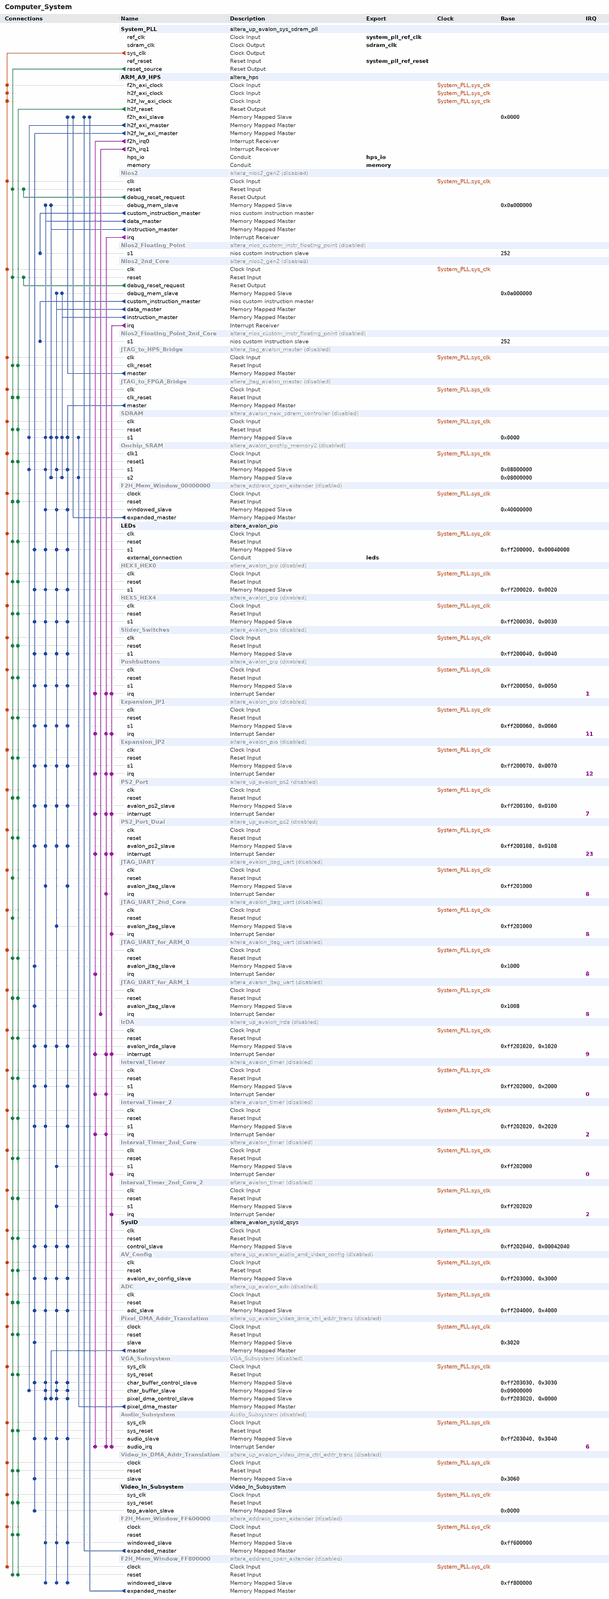
[diagram p0: system contents, whole]
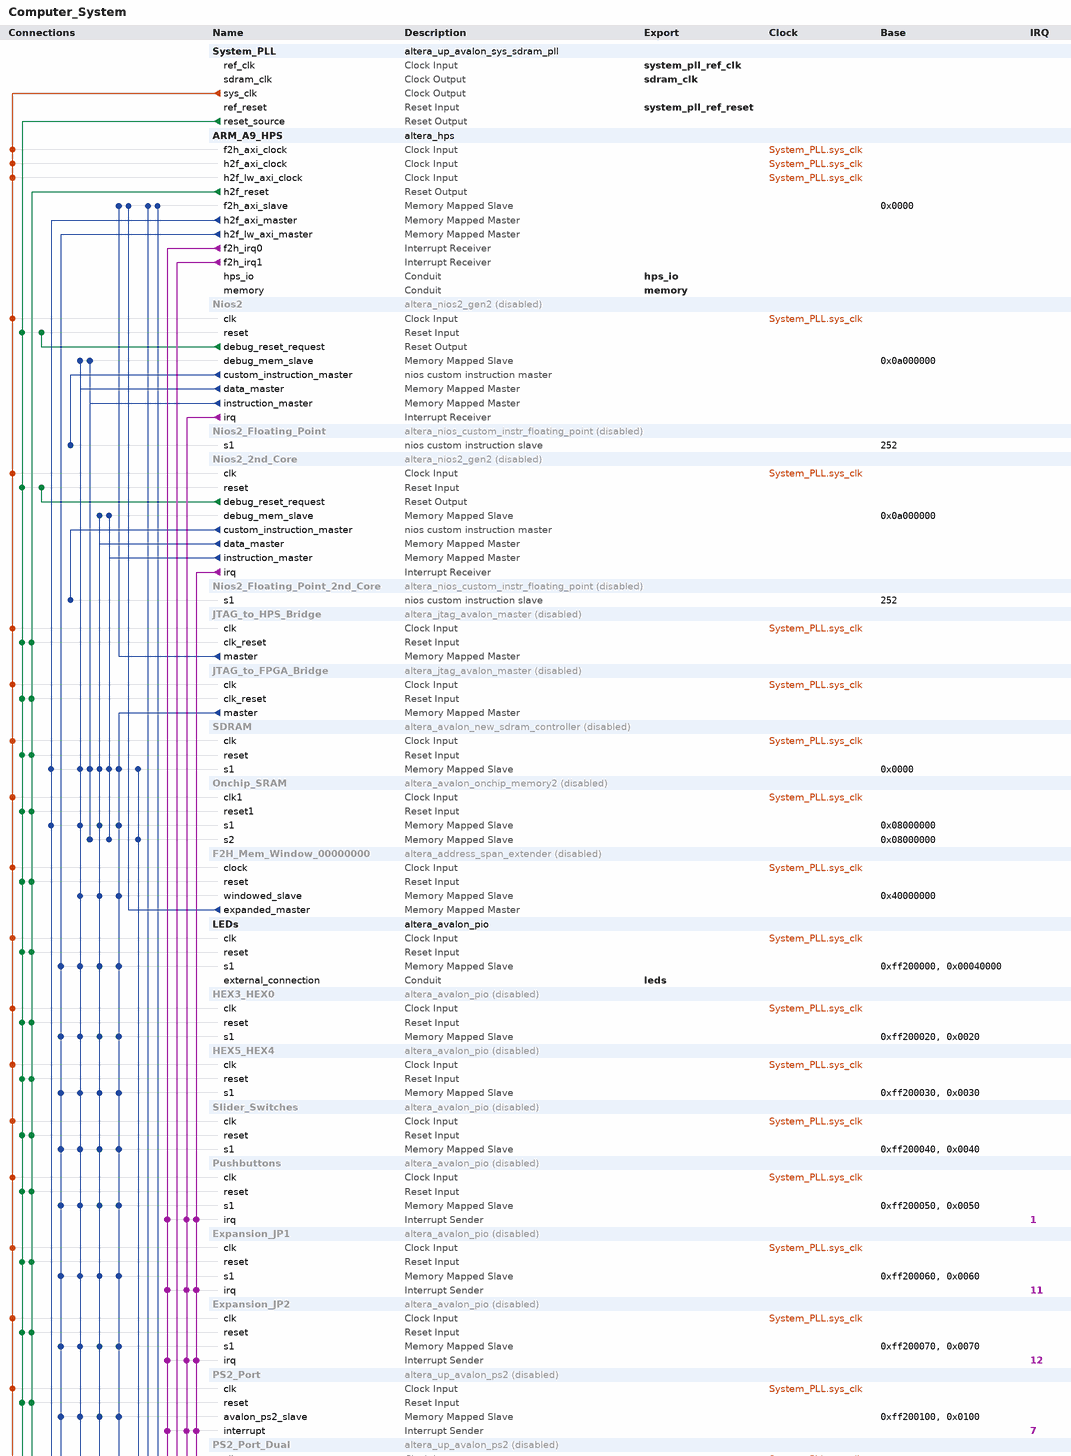
[diagram p1: system contents, upper part]
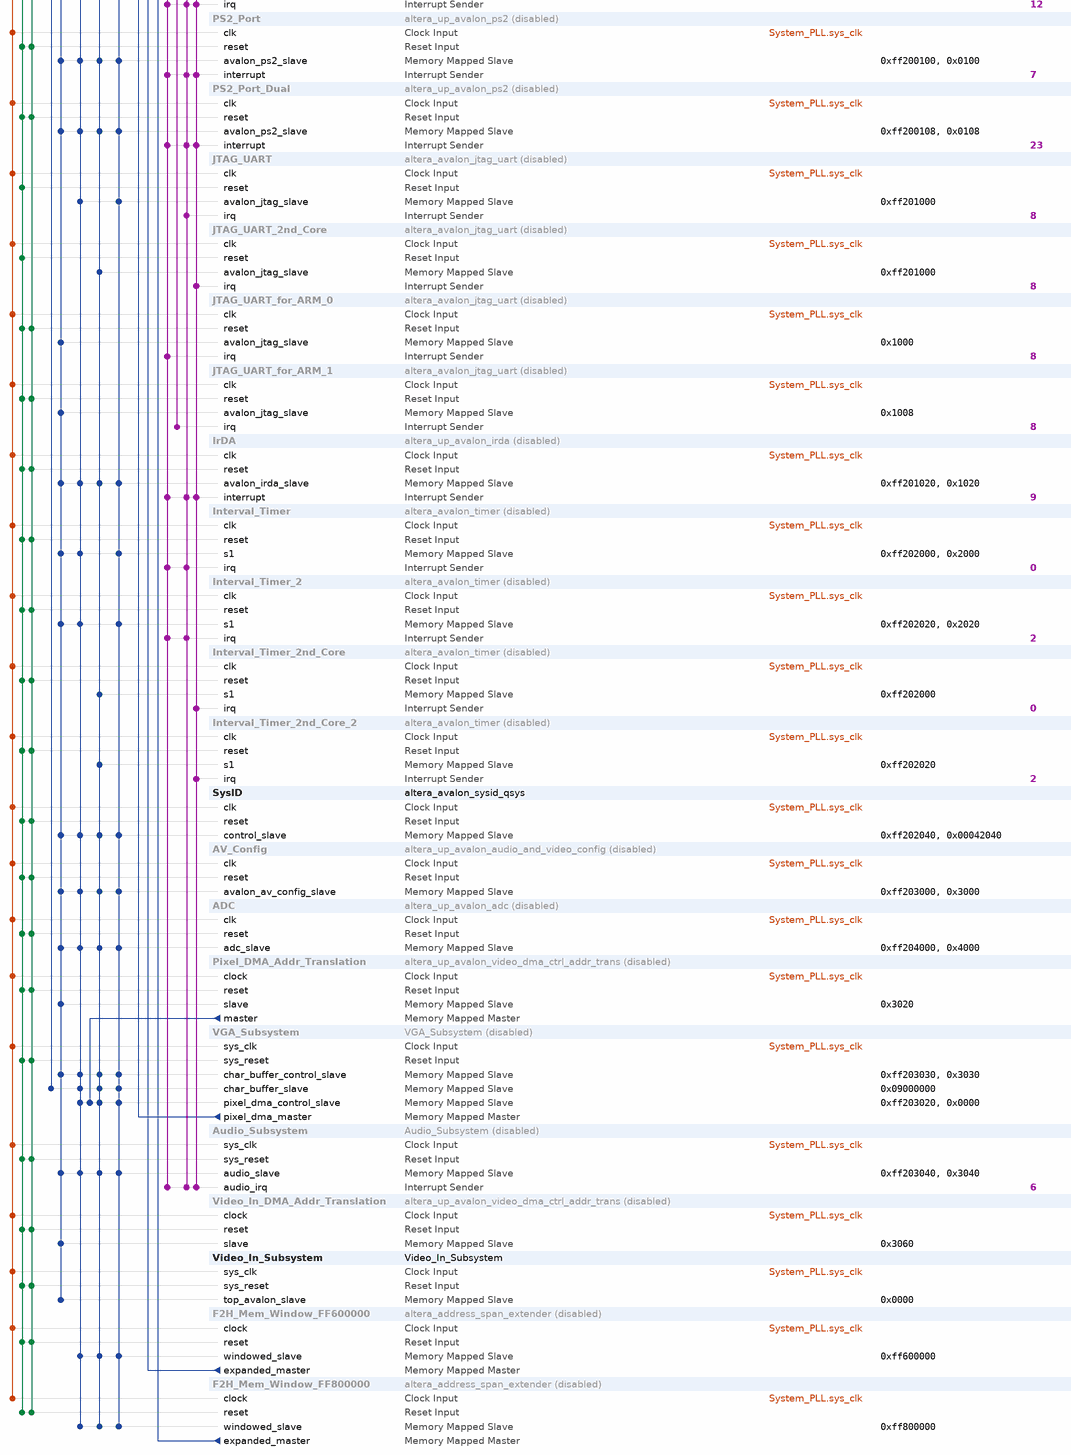
[diagram p2: system contents, lower part]
# Platform Designer (Qsys) system Computer_System, Cyclone V 5CSEMA5F31C6
# Parameters at their usual value, and those the tool derives, are not listed.
package require -exact qsys 16.1
create_system Computer_System
set_project_property DEVICE_FAMILY {Cyclone V}
set_project_property DEVICE 5CSEMA5F31C6

add_instance System_PLL altera_up_avalon_sys_sdram_pll 16.1
set_instance_parameter_value System_PLL CV_boards DE1-SoC
set_instance_parameter_value System_PLL gui_outclk 100.0
set_instance_parameter_value System_PLL gui_refclk 50.0

add_instance ARM_A9_HPS altera_hps 16.1
set_instance_parameter_value ARM_A9_HPS EMAC1_Mode RGMII
set_instance_parameter_value ARM_A9_HPS EMAC1_PinMuxing {HPS I/O Set 0}
set_instance_parameter_value ARM_A9_HPS F2SCLK_COLDRST_Enable false
set_instance_parameter_value ARM_A9_HPS F2SCLK_DBGRST_Enable false
set_instance_parameter_value ARM_A9_HPS F2SCLK_WARMRST_Enable false
set_instance_parameter_value ARM_A9_HPS F2SINTERRUPT_Enable true
set_instance_parameter_value ARM_A9_HPS F2S_Width 2
set_instance_parameter_value ARM_A9_HPS FPGA_PERIPHERAL_OUTPUT_CLOCK_FREQ_EMAC0_GTX_CLK 125
set_instance_parameter_value ARM_A9_HPS FPGA_PERIPHERAL_OUTPUT_CLOCK_FREQ_EMAC0_MD_CLK 100.0
set_instance_parameter_value ARM_A9_HPS FPGA_PERIPHERAL_OUTPUT_CLOCK_FREQ_EMAC1_GTX_CLK 125
set_instance_parameter_value ARM_A9_HPS FPGA_PERIPHERAL_OUTPUT_CLOCK_FREQ_EMAC1_MD_CLK 100.0
set_instance_parameter_value ARM_A9_HPS HPS_PROTOCOL DDR3
set_instance_parameter_value ARM_A9_HPS I2C0_Mode I2C
set_instance_parameter_value ARM_A9_HPS I2C0_PinMuxing {HPS I/O Set 0}
set_instance_parameter_value ARM_A9_HPS I2C1_Mode I2C
set_instance_parameter_value ARM_A9_HPS I2C1_PinMuxing {HPS I/O Set 0}
set_instance_parameter_value ARM_A9_HPS LWH2F_Enable true
set_instance_parameter_value ARM_A9_HPS MEM_BANKADDR_WIDTH 3
set_instance_parameter_value ARM_A9_HPS MEM_CLK_FREQ 400.0
set_instance_parameter_value ARM_A9_HPS MEM_COL_ADDR_WIDTH 10
set_instance_parameter_value ARM_A9_HPS MEM_DQ_WIDTH 32
set_instance_parameter_value ARM_A9_HPS MEM_DRV_STR RZQ/7
set_instance_parameter_value ARM_A9_HPS MEM_ROW_ADDR_WIDTH 15
set_instance_parameter_value ARM_A9_HPS MEM_RTT_NOM RZQ/4
set_instance_parameter_value ARM_A9_HPS MEM_RTT_WR RZQ/4
set_instance_parameter_value ARM_A9_HPS MEM_TCL 11
set_instance_parameter_value ARM_A9_HPS MEM_TFAW_NS 30.0
set_instance_parameter_value ARM_A9_HPS MEM_TRAS_NS 35.0
set_instance_parameter_value ARM_A9_HPS MEM_TRCD_NS 13.75
set_instance_parameter_value ARM_A9_HPS MEM_TRFC_NS 260.0
set_instance_parameter_value ARM_A9_HPS MEM_TRP_NS 13.75
set_instance_parameter_value ARM_A9_HPS MEM_VENDOR JEDEC
set_instance_parameter_value ARM_A9_HPS MEM_WTCL 8
set_instance_parameter_value ARM_A9_HPS QSPI_Mode {1 SS}
set_instance_parameter_value ARM_A9_HPS QSPI_PinMuxing {HPS I/O Set 0}
set_instance_parameter_value ARM_A9_HPS REF_CLK_FREQ 25.0
set_instance_parameter_value ARM_A9_HPS S2FCLK_USER2CLK 5
set_instance_parameter_value ARM_A9_HPS S2F_Width 3
set_instance_parameter_value ARM_A9_HPS SDIO_Mode {4-bit Data}
set_instance_parameter_value ARM_A9_HPS SDIO_PinMuxing {HPS I/O Set 0}
set_instance_parameter_value ARM_A9_HPS SPIM1_Mode {Single Slave Select}
set_instance_parameter_value ARM_A9_HPS SPIM1_PinMuxing {HPS I/O Set 0}
set_instance_parameter_value ARM_A9_HPS STM_Enable false
set_instance_parameter_value ARM_A9_HPS TIMING_BOARD_AC_SKEW 0.03
set_instance_parameter_value ARM_A9_HPS TIMING_BOARD_AC_TO_CK_SKEW 0.0
set_instance_parameter_value ARM_A9_HPS TIMING_BOARD_DQ_TO_DQS_SKEW 0.0
set_instance_parameter_value ARM_A9_HPS TIMING_BOARD_MAX_CK_DELAY 0.03
set_instance_parameter_value ARM_A9_HPS TIMING_BOARD_MAX_DQS_DELAY 0.02
set_instance_parameter_value ARM_A9_HPS TIMING_BOARD_SKEW_BETWEEN_DQS 0.08
set_instance_parameter_value ARM_A9_HPS TIMING_BOARD_SKEW_CKDQS_DIMM_MAX 0.16
set_instance_parameter_value ARM_A9_HPS TIMING_BOARD_SKEW_CKDQS_DIMM_MIN 0.09
set_instance_parameter_value ARM_A9_HPS TIMING_BOARD_SKEW_WITHIN_DQS 0.01
set_instance_parameter_value ARM_A9_HPS TIMING_TDH 65
set_instance_parameter_value ARM_A9_HPS TIMING_TDQSCK 255
set_instance_parameter_value ARM_A9_HPS TIMING_TDQSQ 125
set_instance_parameter_value ARM_A9_HPS TIMING_TDS 30
set_instance_parameter_value ARM_A9_HPS TIMING_TIH 140
set_instance_parameter_value ARM_A9_HPS TIMING_TIS 180
set_instance_parameter_value ARM_A9_HPS TIMING_TQSH 0.4
set_instance_parameter_value ARM_A9_HPS UART0_Mode {No Flow Control}
set_instance_parameter_value ARM_A9_HPS UART0_PinMuxing {HPS I/O Set 0}
set_instance_parameter_value ARM_A9_HPS USB1_Mode SDR
set_instance_parameter_value ARM_A9_HPS USB1_PinMuxing {HPS I/O Set 0}
set_instance_parameter_value ARM_A9_HPS desired_cfg_clk_mhz 100.0
set_instance_parameter_value ARM_A9_HPS desired_qspi_clk_mhz 400.0
set_instance_parameter_value ARM_A9_HPS use_default_mpu_clk false

add_instance Nios2 altera_nios2_gen2 16.1
set_instance_property Nios2 ENABLED false
set_instance_parameter_value Nios2 dcache_size 0
set_instance_parameter_value Nios2 debug_datatrigger 2
set_instance_parameter_value Nios2 debug_hwbreakpoint 2
set_instance_parameter_value Nios2 debug_traceType instruction_trace
set_instance_parameter_value Nios2 dividerType srt2
set_instance_parameter_value Nios2 exceptionSlave SDRAM.s1
set_instance_parameter_value Nios2 icache_size 4096
set_instance_parameter_value Nios2 impl Fast
set_instance_parameter_value Nios2 mul_64_impl 1
set_instance_parameter_value Nios2 mul_shift_choice 1
set_instance_parameter_value Nios2 resetSlave SDRAM.s1
set_instance_parameter_value Nios2 resetrequest_enabled false
set_instance_parameter_value Nios2 setting_support31bitdcachebypass false

add_instance Nios2_Floating_Point altera_nios_custom_instr_floating_point 16.1
set_instance_property Nios2_Floating_Point ENABLED false

add_instance Nios2_2nd_Core altera_nios2_gen2 16.1
set_instance_property Nios2_2nd_Core ENABLED false
set_instance_parameter_value Nios2_2nd_Core cpuID 1
set_instance_parameter_value Nios2_2nd_Core dcache_size 0
set_instance_parameter_value Nios2_2nd_Core debug_datatrigger 2
set_instance_parameter_value Nios2_2nd_Core debug_hwbreakpoint 2
set_instance_parameter_value Nios2_2nd_Core debug_traceType instruction_trace
set_instance_parameter_value Nios2_2nd_Core dividerType srt2
set_instance_parameter_value Nios2_2nd_Core exceptionOffset 33554464
set_instance_parameter_value Nios2_2nd_Core exceptionSlave SDRAM.s1
set_instance_parameter_value Nios2_2nd_Core icache_size 4096
set_instance_parameter_value Nios2_2nd_Core impl Fast
set_instance_parameter_value Nios2_2nd_Core mul_64_impl 1
set_instance_parameter_value Nios2_2nd_Core mul_shift_choice 1
set_instance_parameter_value Nios2_2nd_Core resetOffset 33554432
set_instance_parameter_value Nios2_2nd_Core resetSlave SDRAM.s1
set_instance_parameter_value Nios2_2nd_Core resetrequest_enabled false
set_instance_parameter_value Nios2_2nd_Core setting_support31bitdcachebypass false

add_instance Nios2_Floating_Point_2nd_Core altera_nios_custom_instr_floating_point 16.1
set_instance_property Nios2_Floating_Point_2nd_Core ENABLED false

add_instance JTAG_to_HPS_Bridge altera_jtag_avalon_master 16.1
set_instance_property JTAG_to_HPS_Bridge ENABLED false

add_instance JTAG_to_FPGA_Bridge altera_jtag_avalon_master 16.1
set_instance_property JTAG_to_FPGA_Bridge ENABLED false

add_instance SDRAM altera_avalon_new_sdram_controller 16.1
set_instance_property SDRAM ENABLED false
set_instance_parameter_value SDRAM TAC 5.5
set_instance_parameter_value SDRAM TRCD 20.0
set_instance_parameter_value SDRAM TRP 20.0
set_instance_parameter_value SDRAM casLatency 3
set_instance_parameter_value SDRAM columnWidth 10
set_instance_parameter_value SDRAM dataWidth 16
set_instance_parameter_value SDRAM generateSimulationModel true
set_instance_parameter_value SDRAM model single_Micron_MT48LC4M32B2_7_chip
set_instance_parameter_value SDRAM numberOfBanks 4
set_instance_parameter_value SDRAM numberOfChipSelects 1
set_instance_parameter_value SDRAM powerUpDelay 100.0
set_instance_parameter_value SDRAM refreshPeriod 15.625
set_instance_parameter_value SDRAM rowWidth 13

add_instance Onchip_SRAM altera_avalon_onchip_memory2 16.1
set_instance_property Onchip_SRAM ENABLED false
set_instance_parameter_value Onchip_SRAM dataWidth 32
set_instance_parameter_value Onchip_SRAM dualPort true
set_instance_parameter_value Onchip_SRAM initMemContent true
set_instance_parameter_value Onchip_SRAM initializationFileName onchip_mem.hex
set_instance_parameter_value Onchip_SRAM memorySize 262144
set_instance_parameter_value Onchip_SRAM singleClockOperation true

add_instance F2H_Mem_Window_00000000 altera_address_span_extender 16.1
set_instance_property F2H_Mem_Window_00000000 ENABLED false
set_instance_parameter_value F2H_Mem_Window_00000000 BURSTCOUNT_WIDTH 1
set_instance_parameter_value F2H_Mem_Window_00000000 DATA_WIDTH 32
set_instance_parameter_value F2H_Mem_Window_00000000 ENABLE_SLAVE_PORT false
set_instance_parameter_value F2H_Mem_Window_00000000 MASTER_ADDRESS_DEF 0
set_instance_parameter_value F2H_Mem_Window_00000000 MAX_PENDING_READS 1
set_instance_parameter_value F2H_Mem_Window_00000000 SLAVE_ADDRESS_WIDTH 28

add_instance LEDs altera_avalon_pio 16.1
set_instance_parameter_value LEDs direction Output
set_instance_parameter_value LEDs width 10

add_instance HEX3_HEX0 altera_avalon_pio 16.1
set_instance_property HEX3_HEX0 ENABLED false
set_instance_parameter_value HEX3_HEX0 direction Output
set_instance_parameter_value HEX3_HEX0 width 32

add_instance HEX5_HEX4 altera_avalon_pio 16.1
set_instance_property HEX5_HEX4 ENABLED false
set_instance_parameter_value HEX5_HEX4 direction Output
set_instance_parameter_value HEX5_HEX4 width 16

add_instance Slider_Switches altera_avalon_pio 16.1
set_instance_property Slider_Switches ENABLED false
set_instance_parameter_value Slider_Switches direction Input
set_instance_parameter_value Slider_Switches simDoTestBenchWiring true
set_instance_parameter_value Slider_Switches width 10

add_instance Pushbuttons altera_avalon_pio 16.1
set_instance_property Pushbuttons ENABLED false
set_instance_parameter_value Pushbuttons bitClearingEdgeCapReg true
set_instance_parameter_value Pushbuttons captureEdge true
set_instance_parameter_value Pushbuttons direction Input
set_instance_parameter_value Pushbuttons edgeType FALLING
set_instance_parameter_value Pushbuttons generateIRQ true
set_instance_parameter_value Pushbuttons irqType EDGE
set_instance_parameter_value Pushbuttons simDoTestBenchWiring true
set_instance_parameter_value Pushbuttons width 4

add_instance Expansion_JP1 altera_avalon_pio 16.1
set_instance_property Expansion_JP1 ENABLED false
set_instance_parameter_value Expansion_JP1 bitClearingEdgeCapReg true
set_instance_parameter_value Expansion_JP1 captureEdge true
set_instance_parameter_value Expansion_JP1 direction Bidir
set_instance_parameter_value Expansion_JP1 edgeType FALLING
set_instance_parameter_value Expansion_JP1 generateIRQ true
set_instance_parameter_value Expansion_JP1 irqType EDGE
set_instance_parameter_value Expansion_JP1 simDoTestBenchWiring true
set_instance_parameter_value Expansion_JP1 width 32

add_instance Expansion_JP2 altera_avalon_pio 16.1
set_instance_property Expansion_JP2 ENABLED false
set_instance_parameter_value Expansion_JP2 bitClearingEdgeCapReg true
set_instance_parameter_value Expansion_JP2 captureEdge true
set_instance_parameter_value Expansion_JP2 direction Bidir
set_instance_parameter_value Expansion_JP2 edgeType FALLING
set_instance_parameter_value Expansion_JP2 generateIRQ true
set_instance_parameter_value Expansion_JP2 irqType EDGE
set_instance_parameter_value Expansion_JP2 simDoTestBenchWiring true
set_instance_parameter_value Expansion_JP2 width 32

add_instance PS2_Port altera_up_avalon_ps2 16.1
set_instance_property PS2_Port ENABLED false

add_instance PS2_Port_Dual altera_up_avalon_ps2 16.1
set_instance_property PS2_Port_Dual ENABLED false

add_instance JTAG_UART altera_avalon_jtag_uart 16.1
set_instance_property JTAG_UART ENABLED false
set_instance_parameter_value JTAG_UART simInteractiveOptions NO_INTERACTIVE_WINDOWS

add_instance JTAG_UART_2nd_Core altera_avalon_jtag_uart 16.1
set_instance_property JTAG_UART_2nd_Core ENABLED false
set_instance_parameter_value JTAG_UART_2nd_Core simInteractiveOptions NO_INTERACTIVE_WINDOWS

add_instance JTAG_UART_for_ARM_0 altera_avalon_jtag_uart 16.1
set_instance_property JTAG_UART_for_ARM_0 ENABLED false
set_instance_parameter_value JTAG_UART_for_ARM_0 simInteractiveOptions NO_INTERACTIVE_WINDOWS

add_instance JTAG_UART_for_ARM_1 altera_avalon_jtag_uart 16.1
set_instance_property JTAG_UART_for_ARM_1 ENABLED false
set_instance_parameter_value JTAG_UART_for_ARM_1 simInteractiveOptions NO_INTERACTIVE_WINDOWS

add_instance IrDA altera_up_avalon_irda 16.1
set_instance_property IrDA ENABLED false
set_instance_parameter_value IrDA baud 115200
set_instance_parameter_value IrDA clk_rate 100000000
set_instance_parameter_value IrDA parity None

add_instance Interval_Timer altera_avalon_timer 16.1
set_instance_property Interval_Timer ENABLED false
set_instance_parameter_value Interval_Timer period 125.0
set_instance_parameter_value Interval_Timer periodUnits MSEC

add_instance Interval_Timer_2 altera_avalon_timer 16.1
set_instance_property Interval_Timer_2 ENABLED false
set_instance_parameter_value Interval_Timer_2 period 125.0
set_instance_parameter_value Interval_Timer_2 periodUnits MSEC

add_instance Interval_Timer_2nd_Core altera_avalon_timer 16.1
set_instance_property Interval_Timer_2nd_Core ENABLED false
set_instance_parameter_value Interval_Timer_2nd_Core period 125.0
set_instance_parameter_value Interval_Timer_2nd_Core periodUnits MSEC

add_instance Interval_Timer_2nd_Core_2 altera_avalon_timer 16.1
set_instance_property Interval_Timer_2nd_Core_2 ENABLED false
set_instance_parameter_value Interval_Timer_2nd_Core_2 period 125.0
set_instance_parameter_value Interval_Timer_2nd_Core_2 periodUnits MSEC

add_instance SysID altera_avalon_sysid_qsys 16.1
set_instance_parameter_value SysID id 0

add_instance AV_Config altera_up_avalon_audio_and_video_config 16.1
set_instance_property AV_Config ENABLED false
set_instance_parameter_value AV_Config audio_in {Microphone to ADC}
set_instance_parameter_value AV_Config bit_length 32
set_instance_parameter_value AV_Config board DE1-SoC
set_instance_parameter_value AV_Config line_in_bypass true
set_instance_parameter_value AV_Config sampling_rate {48 kHz}

add_instance ADC altera_up_avalon_adc 16.1
set_instance_property ADC ENABLED false
set_instance_parameter_value ADC board DE1-SoC
set_instance_parameter_value ADC numch_ 8

add_instance Pixel_DMA_Addr_Translation altera_up_avalon_video_dma_ctrl_addr_trans 16.1
set_instance_property Pixel_DMA_Addr_Translation ENABLED false

add_instance VGA_Subsystem VGA_Subsystem 1.0
set_instance_property VGA_Subsystem ENABLED false

add_instance Audio_Subsystem Audio_Subsystem 1.0
set_instance_property Audio_Subsystem ENABLED false

add_instance Video_In_DMA_Addr_Translation altera_up_avalon_video_dma_ctrl_addr_trans 16.1
set_instance_property Video_In_DMA_Addr_Translation ENABLED false

add_instance Video_In_Subsystem Video_In_Subsystem 1.0

add_instance F2H_Mem_Window_FF600000 altera_address_span_extender 16.1
set_instance_property F2H_Mem_Window_FF600000 ENABLED false
set_instance_parameter_value F2H_Mem_Window_FF600000 BURSTCOUNT_WIDTH 1
set_instance_parameter_value F2H_Mem_Window_FF600000 DATA_WIDTH 32
set_instance_parameter_value F2H_Mem_Window_FF600000 ENABLE_SLAVE_PORT false
set_instance_parameter_value F2H_Mem_Window_FF600000 MASTER_ADDRESS_DEF 4284481536
set_instance_parameter_value F2H_Mem_Window_FF600000 MAX_PENDING_READS 1
set_instance_parameter_value F2H_Mem_Window_FF600000 SLAVE_ADDRESS_WIDTH 19

add_instance F2H_Mem_Window_FF800000 altera_address_span_extender 16.1
set_instance_property F2H_Mem_Window_FF800000 ENABLED false
set_instance_parameter_value F2H_Mem_Window_FF800000 BURSTCOUNT_WIDTH 1
set_instance_parameter_value F2H_Mem_Window_FF800000 DATA_WIDTH 32
set_instance_parameter_value F2H_Mem_Window_FF800000 ENABLE_SLAVE_PORT false
set_instance_parameter_value F2H_Mem_Window_FF800000 MASTER_ADDRESS_DEF 4286578688
set_instance_parameter_value F2H_Mem_Window_FF800000 MAX_PENDING_READS 1
set_instance_parameter_value F2H_Mem_Window_FF800000 SLAVE_ADDRESS_WIDTH 21

# connections
add_connection System_PLL.sys_clk ADC.clk clock
add_connection System_PLL.sys_clk ARM_A9_HPS.f2h_axi_clock clock
add_connection System_PLL.sys_clk ARM_A9_HPS.h2f_axi_clock clock
add_connection System_PLL.sys_clk ARM_A9_HPS.h2f_lw_axi_clock clock
add_connection System_PLL.sys_clk Audio_Subsystem.sys_clk clock
add_connection System_PLL.sys_clk AV_Config.clk clock
add_connection System_PLL.sys_clk Expansion_JP1.clk clock
add_connection System_PLL.sys_clk Expansion_JP2.clk clock
add_connection System_PLL.sys_clk F2H_Mem_Window_00000000.clock clock
add_connection System_PLL.sys_clk F2H_Mem_Window_FF600000.clock clock
add_connection System_PLL.sys_clk F2H_Mem_Window_FF800000.clock clock
add_connection System_PLL.sys_clk HEX3_HEX0.clk clock
add_connection System_PLL.sys_clk HEX5_HEX4.clk clock
add_connection System_PLL.sys_clk Interval_Timer.clk clock
add_connection System_PLL.sys_clk Interval_Timer_2.clk clock
add_connection System_PLL.sys_clk Interval_Timer_2nd_Core.clk clock
add_connection System_PLL.sys_clk Interval_Timer_2nd_Core_2.clk clock
add_connection System_PLL.sys_clk IrDA.clk clock
add_connection System_PLL.sys_clk JTAG_to_FPGA_Bridge.clk clock
add_connection System_PLL.sys_clk JTAG_to_HPS_Bridge.clk clock
add_connection System_PLL.sys_clk JTAG_UART.clk clock
add_connection System_PLL.sys_clk JTAG_UART_2nd_Core.clk clock
add_connection System_PLL.sys_clk JTAG_UART_for_ARM_0.clk clock
add_connection System_PLL.sys_clk JTAG_UART_for_ARM_1.clk clock
add_connection System_PLL.sys_clk LEDs.clk clock
add_connection System_PLL.sys_clk Nios2.clk clock
add_connection System_PLL.sys_clk Nios2_2nd_Core.clk clock
add_connection System_PLL.sys_clk Onchip_SRAM.clk1 clock
add_connection System_PLL.sys_clk Pixel_DMA_Addr_Translation.clock clock
add_connection System_PLL.sys_clk PS2_Port.clk clock
add_connection System_PLL.sys_clk PS2_Port_Dual.clk clock
add_connection System_PLL.sys_clk Pushbuttons.clk clock
add_connection System_PLL.sys_clk SDRAM.clk clock
add_connection System_PLL.sys_clk Slider_Switches.clk clock
add_connection System_PLL.sys_clk SysID.clk clock
add_connection System_PLL.sys_clk VGA_Subsystem.sys_clk clock
add_connection System_PLL.sys_clk Video_In_DMA_Addr_Translation.clock clock
add_connection System_PLL.sys_clk Video_In_Subsystem.sys_clk clock
add_connection ARM_A9_HPS.h2f_reset ADC.reset reset
add_connection ARM_A9_HPS.h2f_reset Audio_Subsystem.sys_reset reset
add_connection ARM_A9_HPS.h2f_reset AV_Config.reset reset
add_connection ARM_A9_HPS.h2f_reset Expansion_JP1.reset reset
add_connection ARM_A9_HPS.h2f_reset Expansion_JP2.reset reset
add_connection ARM_A9_HPS.h2f_reset F2H_Mem_Window_00000000.reset reset
add_connection ARM_A9_HPS.h2f_reset F2H_Mem_Window_FF600000.reset reset
add_connection ARM_A9_HPS.h2f_reset F2H_Mem_Window_FF800000.reset reset
add_connection ARM_A9_HPS.h2f_reset HEX3_HEX0.reset reset
add_connection ARM_A9_HPS.h2f_reset HEX5_HEX4.reset reset
add_connection ARM_A9_HPS.h2f_reset Interval_Timer.reset reset
add_connection ARM_A9_HPS.h2f_reset Interval_Timer_2.reset reset
add_connection ARM_A9_HPS.h2f_reset Interval_Timer_2nd_Core.reset reset
add_connection ARM_A9_HPS.h2f_reset Interval_Timer_2nd_Core_2.reset reset
add_connection ARM_A9_HPS.h2f_reset IrDA.reset reset
add_connection ARM_A9_HPS.h2f_reset JTAG_to_FPGA_Bridge.clk_reset reset
add_connection ARM_A9_HPS.h2f_reset JTAG_to_HPS_Bridge.clk_reset reset
add_connection ARM_A9_HPS.h2f_reset JTAG_UART_for_ARM_0.reset reset
add_connection ARM_A9_HPS.h2f_reset JTAG_UART_for_ARM_1.reset reset
add_connection ARM_A9_HPS.h2f_reset LEDs.reset reset
add_connection ARM_A9_HPS.h2f_reset Onchip_SRAM.reset1 reset
add_connection ARM_A9_HPS.h2f_reset Pixel_DMA_Addr_Translation.reset reset
add_connection ARM_A9_HPS.h2f_reset PS2_Port.reset reset
add_connection ARM_A9_HPS.h2f_reset PS2_Port_Dual.reset reset
add_connection ARM_A9_HPS.h2f_reset Pushbuttons.reset reset
add_connection ARM_A9_HPS.h2f_reset SDRAM.reset reset
add_connection ARM_A9_HPS.h2f_reset Slider_Switches.reset reset
add_connection ARM_A9_HPS.h2f_reset SysID.reset reset
add_connection ARM_A9_HPS.h2f_reset VGA_Subsystem.sys_reset reset
add_connection ARM_A9_HPS.h2f_reset Video_In_DMA_Addr_Translation.reset reset
add_connection ARM_A9_HPS.h2f_reset Video_In_Subsystem.sys_reset reset
add_connection Nios2.debug_reset_request Nios2.reset reset
add_connection Nios2_2nd_Core.debug_reset_request Nios2_2nd_Core.reset reset
add_connection System_PLL.reset_source ADC.reset reset
add_connection System_PLL.reset_source Audio_Subsystem.sys_reset reset
add_connection System_PLL.reset_source AV_Config.reset reset
add_connection System_PLL.reset_source Expansion_JP1.reset reset
add_connection System_PLL.reset_source Expansion_JP2.reset reset
add_connection System_PLL.reset_source F2H_Mem_Window_00000000.reset reset
add_connection System_PLL.reset_source F2H_Mem_Window_FF600000.reset reset
add_connection System_PLL.reset_source F2H_Mem_Window_FF800000.reset reset
add_connection System_PLL.reset_source HEX3_HEX0.reset reset
add_connection System_PLL.reset_source HEX5_HEX4.reset reset
add_connection System_PLL.reset_source Interval_Timer.reset reset
add_connection System_PLL.reset_source Interval_Timer_2.reset reset
add_connection System_PLL.reset_source Interval_Timer_2nd_Core.reset reset
add_connection System_PLL.reset_source Interval_Timer_2nd_Core_2.reset reset
add_connection System_PLL.reset_source IrDA.reset reset
add_connection System_PLL.reset_source JTAG_to_FPGA_Bridge.clk_reset reset
add_connection System_PLL.reset_source JTAG_to_HPS_Bridge.clk_reset reset
add_connection System_PLL.reset_source JTAG_UART.reset reset
add_connection System_PLL.reset_source JTAG_UART_2nd_Core.reset reset
add_connection System_PLL.reset_source JTAG_UART_for_ARM_0.reset reset
add_connection System_PLL.reset_source JTAG_UART_for_ARM_1.reset reset
add_connection System_PLL.reset_source LEDs.reset reset
add_connection System_PLL.reset_source Nios2.reset reset
add_connection System_PLL.reset_source Nios2_2nd_Core.reset reset
add_connection System_PLL.reset_source Onchip_SRAM.reset1 reset
add_connection System_PLL.reset_source Pixel_DMA_Addr_Translation.reset reset
add_connection System_PLL.reset_source PS2_Port.reset reset
add_connection System_PLL.reset_source PS2_Port_Dual.reset reset
add_connection System_PLL.reset_source Pushbuttons.reset reset
add_connection System_PLL.reset_source SDRAM.reset reset
add_connection System_PLL.reset_source Slider_Switches.reset reset
add_connection System_PLL.reset_source SysID.reset reset
add_connection System_PLL.reset_source VGA_Subsystem.sys_reset reset
add_connection System_PLL.reset_source Video_In_DMA_Addr_Translation.reset reset
add_connection System_PLL.reset_source Video_In_Subsystem.sys_reset reset
add_connection ARM_A9_HPS.h2f_axi_master Onchip_SRAM.s1 avalon
set_connection_parameter_value ARM_A9_HPS.h2f_axi_master/Onchip_SRAM.s1 baseAddress 0x08000000
add_connection ARM_A9_HPS.h2f_axi_master SDRAM.s1 avalon
set_connection_parameter_value ARM_A9_HPS.h2f_axi_master/SDRAM.s1 baseAddress 0x0000
add_connection ARM_A9_HPS.h2f_axi_master VGA_Subsystem.char_buffer_slave avalon
set_connection_parameter_value ARM_A9_HPS.h2f_axi_master/VGA_Subsystem.char_buffer_slave baseAddress 0x09000000
add_connection ARM_A9_HPS.h2f_lw_axi_master ADC.adc_slave avalon
set_connection_parameter_value ARM_A9_HPS.h2f_lw_axi_master/ADC.adc_slave baseAddress 0x4000
add_connection ARM_A9_HPS.h2f_lw_axi_master Audio_Subsystem.audio_slave avalon
set_connection_parameter_value ARM_A9_HPS.h2f_lw_axi_master/Audio_Subsystem.audio_slave baseAddress 0x3040
add_connection ARM_A9_HPS.h2f_lw_axi_master AV_Config.avalon_av_config_slave avalon
set_connection_parameter_value ARM_A9_HPS.h2f_lw_axi_master/AV_Config.avalon_av_config_slave baseAddress 0x3000
add_connection ARM_A9_HPS.h2f_lw_axi_master Expansion_JP1.s1 avalon
set_connection_parameter_value ARM_A9_HPS.h2f_lw_axi_master/Expansion_JP1.s1 baseAddress 0x0060
add_connection ARM_A9_HPS.h2f_lw_axi_master Expansion_JP2.s1 avalon
set_connection_parameter_value ARM_A9_HPS.h2f_lw_axi_master/Expansion_JP2.s1 baseAddress 0x0070
add_connection ARM_A9_HPS.h2f_lw_axi_master HEX3_HEX0.s1 avalon
set_connection_parameter_value ARM_A9_HPS.h2f_lw_axi_master/HEX3_HEX0.s1 baseAddress 0x0020
add_connection ARM_A9_HPS.h2f_lw_axi_master HEX5_HEX4.s1 avalon
set_connection_parameter_value ARM_A9_HPS.h2f_lw_axi_master/HEX5_HEX4.s1 baseAddress 0x0030
add_connection ARM_A9_HPS.h2f_lw_axi_master Interval_Timer.s1 avalon
set_connection_parameter_value ARM_A9_HPS.h2f_lw_axi_master/Interval_Timer.s1 baseAddress 0x2000
add_connection ARM_A9_HPS.h2f_lw_axi_master Interval_Timer_2.s1 avalon
set_connection_parameter_value ARM_A9_HPS.h2f_lw_axi_master/Interval_Timer_2.s1 baseAddress 0x2020
add_connection ARM_A9_HPS.h2f_lw_axi_master IrDA.avalon_irda_slave avalon
set_connection_parameter_value ARM_A9_HPS.h2f_lw_axi_master/IrDA.avalon_irda_slave baseAddress 0x1020
add_connection ARM_A9_HPS.h2f_lw_axi_master JTAG_UART_for_ARM_0.avalon_jtag_slave avalon
set_connection_parameter_value ARM_A9_HPS.h2f_lw_axi_master/JTAG_UART_for_ARM_0.avalon_jtag_slave baseAddress 0x1000
add_connection ARM_A9_HPS.h2f_lw_axi_master JTAG_UART_for_ARM_1.avalon_jtag_slave avalon
set_connection_parameter_value ARM_A9_HPS.h2f_lw_axi_master/JTAG_UART_for_ARM_1.avalon_jtag_slave baseAddress 0x1008
add_connection ARM_A9_HPS.h2f_lw_axi_master LEDs.s1 avalon
set_connection_parameter_value ARM_A9_HPS.h2f_lw_axi_master/LEDs.s1 baseAddress 0x00040000
add_connection ARM_A9_HPS.h2f_lw_axi_master Pixel_DMA_Addr_Translation.slave avalon
set_connection_parameter_value ARM_A9_HPS.h2f_lw_axi_master/Pixel_DMA_Addr_Translation.slave baseAddress 0x3020
add_connection ARM_A9_HPS.h2f_lw_axi_master PS2_Port.avalon_ps2_slave avalon
set_connection_parameter_value ARM_A9_HPS.h2f_lw_axi_master/PS2_Port.avalon_ps2_slave baseAddress 0x0100
add_connection ARM_A9_HPS.h2f_lw_axi_master PS2_Port_Dual.avalon_ps2_slave avalon
set_connection_parameter_value ARM_A9_HPS.h2f_lw_axi_master/PS2_Port_Dual.avalon_ps2_slave baseAddress 0x0108
add_connection ARM_A9_HPS.h2f_lw_axi_master Pushbuttons.s1 avalon
set_connection_parameter_value ARM_A9_HPS.h2f_lw_axi_master/Pushbuttons.s1 baseAddress 0x0050
add_connection ARM_A9_HPS.h2f_lw_axi_master Slider_Switches.s1 avalon
set_connection_parameter_value ARM_A9_HPS.h2f_lw_axi_master/Slider_Switches.s1 baseAddress 0x0040
add_connection ARM_A9_HPS.h2f_lw_axi_master SysID.control_slave avalon
set_connection_parameter_value ARM_A9_HPS.h2f_lw_axi_master/SysID.control_slave baseAddress 0x00042040
add_connection ARM_A9_HPS.h2f_lw_axi_master VGA_Subsystem.char_buffer_control_slave avalon
set_connection_parameter_value ARM_A9_HPS.h2f_lw_axi_master/VGA_Subsystem.char_buffer_control_slave baseAddress 0x3030
add_connection ARM_A9_HPS.h2f_lw_axi_master Video_In_DMA_Addr_Translation.slave avalon
set_connection_parameter_value ARM_A9_HPS.h2f_lw_axi_master/Video_In_DMA_Addr_Translation.slave baseAddress 0x3060
add_connection ARM_A9_HPS.h2f_lw_axi_master Video_In_Subsystem.top_avalon_slave avalon
set_connection_parameter_value ARM_A9_HPS.h2f_lw_axi_master/Video_In_Subsystem.top_avalon_slave baseAddress 0x0000
add_connection F2H_Mem_Window_00000000.expanded_master ARM_A9_HPS.f2h_axi_slave avalon
set_connection_parameter_value F2H_Mem_Window_00000000.expanded_master/ARM_A9_HPS.f2h_axi_slave baseAddress 0x0000
add_connection F2H_Mem_Window_FF600000.expanded_master ARM_A9_HPS.f2h_axi_slave avalon
set_connection_parameter_value F2H_Mem_Window_FF600000.expanded_master/ARM_A9_HPS.f2h_axi_slave baseAddress 0x0000
add_connection F2H_Mem_Window_FF800000.expanded_master ARM_A9_HPS.f2h_axi_slave avalon
set_connection_parameter_value F2H_Mem_Window_FF800000.expanded_master/ARM_A9_HPS.f2h_axi_slave baseAddress 0x0000
add_connection JTAG_to_FPGA_Bridge.master ADC.adc_slave avalon
set_connection_parameter_value JTAG_to_FPGA_Bridge.master/ADC.adc_slave baseAddress 0xff204000
add_connection JTAG_to_FPGA_Bridge.master Audio_Subsystem.audio_slave avalon
set_connection_parameter_value JTAG_to_FPGA_Bridge.master/Audio_Subsystem.audio_slave baseAddress 0xff203040
add_connection JTAG_to_FPGA_Bridge.master AV_Config.avalon_av_config_slave avalon
set_connection_parameter_value JTAG_to_FPGA_Bridge.master/AV_Config.avalon_av_config_slave baseAddress 0xff203000
add_connection JTAG_to_FPGA_Bridge.master Expansion_JP1.s1 avalon
set_connection_parameter_value JTAG_to_FPGA_Bridge.master/Expansion_JP1.s1 baseAddress 0xff200060
add_connection JTAG_to_FPGA_Bridge.master Expansion_JP2.s1 avalon
set_connection_parameter_value JTAG_to_FPGA_Bridge.master/Expansion_JP2.s1 baseAddress 0xff200070
add_connection JTAG_to_FPGA_Bridge.master F2H_Mem_Window_00000000.windowed_slave avalon
set_connection_parameter_value JTAG_to_FPGA_Bridge.master/F2H_Mem_Window_00000000.windowed_slave baseAddress 0x40000000
add_connection JTAG_to_FPGA_Bridge.master F2H_Mem_Window_FF600000.windowed_slave avalon
set_connection_parameter_value JTAG_to_FPGA_Bridge.master/F2H_Mem_Window_FF600000.windowed_slave baseAddress 0xff600000
add_connection JTAG_to_FPGA_Bridge.master F2H_Mem_Window_FF800000.windowed_slave avalon
set_connection_parameter_value JTAG_to_FPGA_Bridge.master/F2H_Mem_Window_FF800000.windowed_slave baseAddress 0xff800000
add_connection JTAG_to_FPGA_Bridge.master HEX3_HEX0.s1 avalon
set_connection_parameter_value JTAG_to_FPGA_Bridge.master/HEX3_HEX0.s1 baseAddress 0xff200020
add_connection JTAG_to_FPGA_Bridge.master HEX5_HEX4.s1 avalon
set_connection_parameter_value JTAG_to_FPGA_Bridge.master/HEX5_HEX4.s1 baseAddress 0xff200030
add_connection JTAG_to_FPGA_Bridge.master Interval_Timer.s1 avalon
set_connection_parameter_value JTAG_to_FPGA_Bridge.master/Interval_Timer.s1 baseAddress 0xff202000
add_connection JTAG_to_FPGA_Bridge.master Interval_Timer_2.s1 avalon
set_connection_parameter_value JTAG_to_FPGA_Bridge.master/Interval_Timer_2.s1 baseAddress 0xff202020
add_connection JTAG_to_FPGA_Bridge.master IrDA.avalon_irda_slave avalon
set_connection_parameter_value JTAG_to_FPGA_Bridge.master/IrDA.avalon_irda_slave baseAddress 0xff201020
add_connection JTAG_to_FPGA_Bridge.master JTAG_UART.avalon_jtag_slave avalon
set_connection_parameter_value JTAG_to_FPGA_Bridge.master/JTAG_UART.avalon_jtag_slave baseAddress 0xff201000
add_connection JTAG_to_FPGA_Bridge.master LEDs.s1 avalon
set_connection_parameter_value JTAG_to_FPGA_Bridge.master/LEDs.s1 baseAddress 0xff200000
add_connection JTAG_to_FPGA_Bridge.master Onchip_SRAM.s1 avalon
set_connection_parameter_value JTAG_to_FPGA_Bridge.master/Onchip_SRAM.s1 baseAddress 0x08000000
add_connection JTAG_to_FPGA_Bridge.master PS2_Port.avalon_ps2_slave avalon
set_connection_parameter_value JTAG_to_FPGA_Bridge.master/PS2_Port.avalon_ps2_slave baseAddress 0xff200100
add_connection JTAG_to_FPGA_Bridge.master PS2_Port_Dual.avalon_ps2_slave avalon
set_connection_parameter_value JTAG_to_FPGA_Bridge.master/PS2_Port_Dual.avalon_ps2_slave baseAddress 0xff200108
add_connection JTAG_to_FPGA_Bridge.master Pushbuttons.s1 avalon
set_connection_parameter_value JTAG_to_FPGA_Bridge.master/Pushbuttons.s1 baseAddress 0xff200050
add_connection JTAG_to_FPGA_Bridge.master SDRAM.s1 avalon
set_connection_parameter_value JTAG_to_FPGA_Bridge.master/SDRAM.s1 baseAddress 0x0000
add_connection JTAG_to_FPGA_Bridge.master Slider_Switches.s1 avalon
set_connection_parameter_value JTAG_to_FPGA_Bridge.master/Slider_Switches.s1 baseAddress 0xff200040
add_connection JTAG_to_FPGA_Bridge.master SysID.control_slave avalon
set_connection_parameter_value JTAG_to_FPGA_Bridge.master/SysID.control_slave baseAddress 0xff202040
add_connection JTAG_to_FPGA_Bridge.master VGA_Subsystem.char_buffer_control_slave avalon
set_connection_parameter_value JTAG_to_FPGA_Bridge.master/VGA_Subsystem.char_buffer_control_slave baseAddress 0xff203030
add_connection JTAG_to_FPGA_Bridge.master VGA_Subsystem.char_buffer_slave avalon
set_connection_parameter_value JTAG_to_FPGA_Bridge.master/VGA_Subsystem.char_buffer_slave baseAddress 0x09000000
add_connection JTAG_to_FPGA_Bridge.master VGA_Subsystem.pixel_dma_control_slave avalon
set_connection_parameter_value JTAG_to_FPGA_Bridge.master/VGA_Subsystem.pixel_dma_control_slave baseAddress 0xff203020
add_connection JTAG_to_HPS_Bridge.master ARM_A9_HPS.f2h_axi_slave avalon
set_connection_parameter_value JTAG_to_HPS_Bridge.master/ARM_A9_HPS.f2h_axi_slave baseAddress 0x0000
add_connection Nios2.data_master ADC.adc_slave avalon
set_connection_parameter_value Nios2.data_master/ADC.adc_slave baseAddress 0xff204000
add_connection Nios2.data_master Audio_Subsystem.audio_slave avalon
set_connection_parameter_value Nios2.data_master/Audio_Subsystem.audio_slave baseAddress 0xff203040
add_connection Nios2.data_master AV_Config.avalon_av_config_slave avalon
set_connection_parameter_value Nios2.data_master/AV_Config.avalon_av_config_slave baseAddress 0xff203000
add_connection Nios2.data_master Expansion_JP1.s1 avalon
set_connection_parameter_value Nios2.data_master/Expansion_JP1.s1 baseAddress 0xff200060
add_connection Nios2.data_master Expansion_JP2.s1 avalon
set_connection_parameter_value Nios2.data_master/Expansion_JP2.s1 baseAddress 0xff200070
add_connection Nios2.data_master F2H_Mem_Window_00000000.windowed_slave avalon
set_connection_parameter_value Nios2.data_master/F2H_Mem_Window_00000000.windowed_slave baseAddress 0x40000000
add_connection Nios2.data_master F2H_Mem_Window_FF600000.windowed_slave avalon
set_connection_parameter_value Nios2.data_master/F2H_Mem_Window_FF600000.windowed_slave baseAddress 0xff600000
add_connection Nios2.data_master F2H_Mem_Window_FF800000.windowed_slave avalon
set_connection_parameter_value Nios2.data_master/F2H_Mem_Window_FF800000.windowed_slave baseAddress 0xff800000
add_connection Nios2.data_master HEX3_HEX0.s1 avalon
set_connection_parameter_value Nios2.data_master/HEX3_HEX0.s1 baseAddress 0xff200020
add_connection Nios2.data_master HEX5_HEX4.s1 avalon
set_connection_parameter_value Nios2.data_master/HEX5_HEX4.s1 baseAddress 0xff200030
add_connection Nios2.data_master Interval_Timer.s1 avalon
set_connection_parameter_value Nios2.data_master/Interval_Timer.s1 baseAddress 0xff202000
add_connection Nios2.data_master Interval_Timer_2.s1 avalon
set_connection_parameter_value Nios2.data_master/Interval_Timer_2.s1 baseAddress 0xff202020
add_connection Nios2.data_master IrDA.avalon_irda_slave avalon
set_connection_parameter_value Nios2.data_master/IrDA.avalon_irda_slave baseAddress 0xff201020
add_connection Nios2.data_master JTAG_UART.avalon_jtag_slave avalon
set_connection_parameter_value Nios2.data_master/JTAG_UART.avalon_jtag_slave baseAddress 0xff201000
add_connection Nios2.data_master LEDs.s1 avalon
set_connection_parameter_value Nios2.data_master/LEDs.s1 baseAddress 0xff200000
add_connection Nios2.data_master Nios2.debug_mem_slave avalon
set_connection_parameter_value Nios2.data_master/Nios2.debug_mem_slave baseAddress 0x0a000000
add_connection Nios2.data_master Onchip_SRAM.s1 avalon
set_connection_parameter_value Nios2.data_master/Onchip_SRAM.s1 baseAddress 0x08000000
add_connection Nios2.data_master PS2_Port.avalon_ps2_slave avalon
set_connection_parameter_value Nios2.data_master/PS2_Port.avalon_ps2_slave baseAddress 0xff200100
add_connection Nios2.data_master PS2_Port_Dual.avalon_ps2_slave avalon
set_connection_parameter_value Nios2.data_master/PS2_Port_Dual.avalon_ps2_slave baseAddress 0xff200108
add_connection Nios2.data_master Pushbuttons.s1 avalon
set_connection_parameter_value Nios2.data_master/Pushbuttons.s1 baseAddress 0xff200050
add_connection Nios2.data_master SDRAM.s1 avalon
set_connection_parameter_value Nios2.data_master/SDRAM.s1 baseAddress 0x0000
add_connection Nios2.data_master Slider_Switches.s1 avalon
set_connection_parameter_value Nios2.data_master/Slider_Switches.s1 baseAddress 0xff200040
add_connection Nios2.data_master SysID.control_slave avalon
set_connection_parameter_value Nios2.data_master/SysID.control_slave baseAddress 0xff202040
add_connection Nios2.data_master VGA_Subsystem.char_buffer_control_slave avalon
set_connection_parameter_value Nios2.data_master/VGA_Subsystem.char_buffer_control_slave baseAddress 0xff203030
add_connection Nios2.data_master VGA_Subsystem.char_buffer_slave avalon
set_connection_parameter_value Nios2.data_master/VGA_Subsystem.char_buffer_slave baseAddress 0x09000000
add_connection Nios2.data_master VGA_Subsystem.pixel_dma_control_slave avalon
set_connection_parameter_value Nios2.data_master/VGA_Subsystem.pixel_dma_control_slave baseAddress 0xff203020
add_connection Nios2.instruction_master Nios2.debug_mem_slave avalon
set_connection_parameter_value Nios2.instruction_master/Nios2.debug_mem_slave baseAddress 0x0a000000
add_connection Nios2.instruction_master Onchip_SRAM.s2 avalon
set_connection_parameter_value Nios2.instruction_master/Onchip_SRAM.s2 baseAddress 0x08000000
add_connection Nios2.instruction_master SDRAM.s1 avalon
set_connection_parameter_value Nios2.instruction_master/SDRAM.s1 baseAddress 0x0000
add_connection Nios2_2nd_Core.data_master ADC.adc_slave avalon
set_connection_parameter_value Nios2_2nd_Core.data_master/ADC.adc_slave baseAddress 0xff204000
add_connection Nios2_2nd_Core.data_master Audio_Subsystem.audio_slave avalon
set_connection_parameter_value Nios2_2nd_Core.data_master/Audio_Subsystem.audio_slave baseAddress 0xff203040
add_connection Nios2_2nd_Core.data_master AV_Config.avalon_av_config_slave avalon
set_connection_parameter_value Nios2_2nd_Core.data_master/AV_Config.avalon_av_config_slave baseAddress 0xff203000
add_connection Nios2_2nd_Core.data_master Expansion_JP1.s1 avalon
set_connection_parameter_value Nios2_2nd_Core.data_master/Expansion_JP1.s1 baseAddress 0xff200060
add_connection Nios2_2nd_Core.data_master Expansion_JP2.s1 avalon
set_connection_parameter_value Nios2_2nd_Core.data_master/Expansion_JP2.s1 baseAddress 0xff200070
add_connection Nios2_2nd_Core.data_master F2H_Mem_Window_00000000.windowed_slave avalon
set_connection_parameter_value Nios2_2nd_Core.data_master/F2H_Mem_Window_00000000.windowed_slave baseAddress 0x40000000
add_connection Nios2_2nd_Core.data_master F2H_Mem_Window_FF600000.windowed_slave avalon
set_connection_parameter_value Nios2_2nd_Core.data_master/F2H_Mem_Window_FF600000.windowed_slave baseAddress 0xff600000
add_connection Nios2_2nd_Core.data_master F2H_Mem_Window_FF800000.windowed_slave avalon
set_connection_parameter_value Nios2_2nd_Core.data_master/F2H_Mem_Window_FF800000.windowed_slave baseAddress 0xff800000
add_connection Nios2_2nd_Core.data_master HEX3_HEX0.s1 avalon
set_connection_parameter_value Nios2_2nd_Core.data_master/HEX3_HEX0.s1 baseAddress 0xff200020
add_connection Nios2_2nd_Core.data_master HEX5_HEX4.s1 avalon
set_connection_parameter_value Nios2_2nd_Core.data_master/HEX5_HEX4.s1 baseAddress 0xff200030
add_connection Nios2_2nd_Core.data_master Interval_Timer_2nd_Core.s1 avalon
set_connection_parameter_value Nios2_2nd_Core.data_master/Interval_Timer_2nd_Core.s1 baseAddress 0xff202000
add_connection Nios2_2nd_Core.data_master Interval_Timer_2nd_Core_2.s1 avalon
set_connection_parameter_value Nios2_2nd_Core.data_master/Interval_Timer_2nd_Core_2.s1 baseAddress 0xff202020
add_connection Nios2_2nd_Core.data_master IrDA.avalon_irda_slave avalon
set_connection_parameter_value Nios2_2nd_Core.data_master/IrDA.avalon_irda_slave baseAddress 0xff201020
add_connection Nios2_2nd_Core.data_master JTAG_UART_2nd_Core.avalon_jtag_slave avalon
set_connection_parameter_value Nios2_2nd_Core.data_master/JTAG_UART_2nd_Core.avalon_jtag_slave baseAddress 0xff201000
add_connection Nios2_2nd_Core.data_master LEDs.s1 avalon
set_connection_parameter_value Nios2_2nd_Core.data_master/LEDs.s1 baseAddress 0xff200000
add_connection Nios2_2nd_Core.data_master Nios2_2nd_Core.debug_mem_slave avalon
set_connection_parameter_value Nios2_2nd_Core.data_master/Nios2_2nd_Core.debug_mem_slave baseAddress 0x0a000000
add_connection Nios2_2nd_Core.data_master Onchip_SRAM.s1 avalon
set_connection_parameter_value Nios2_2nd_Core.data_master/Onchip_SRAM.s1 baseAddress 0x08000000
add_connection Nios2_2nd_Core.data_master PS2_Port.avalon_ps2_slave avalon
set_connection_parameter_value Nios2_2nd_Core.data_master/PS2_Port.avalon_ps2_slave baseAddress 0xff200100
add_connection Nios2_2nd_Core.data_master PS2_Port_Dual.avalon_ps2_slave avalon
set_connection_parameter_value Nios2_2nd_Core.data_master/PS2_Port_Dual.avalon_ps2_slave baseAddress 0xff200108
add_connection Nios2_2nd_Core.data_master Pushbuttons.s1 avalon
set_connection_parameter_value Nios2_2nd_Core.data_master/Pushbuttons.s1 baseAddress 0xff200050
add_connection Nios2_2nd_Core.data_master SDRAM.s1 avalon
set_connection_parameter_value Nios2_2nd_Core.data_master/SDRAM.s1 baseAddress 0x0000
add_connection Nios2_2nd_Core.data_master Slider_Switches.s1 avalon
set_connection_parameter_value Nios2_2nd_Core.data_master/Slider_Switches.s1 baseAddress 0xff200040
add_connection Nios2_2nd_Core.data_master SysID.control_slave avalon
set_connection_parameter_value Nios2_2nd_Core.data_master/SysID.control_slave baseAddress 0xff202040
add_connection Nios2_2nd_Core.data_master VGA_Subsystem.char_buffer_control_slave avalon
set_connection_parameter_value Nios2_2nd_Core.data_master/VGA_Subsystem.char_buffer_control_slave baseAddress 0xff203030
add_connection Nios2_2nd_Core.data_master VGA_Subsystem.char_buffer_slave avalon
set_connection_parameter_value Nios2_2nd_Core.data_master/VGA_Subsystem.char_buffer_slave baseAddress 0x09000000
add_connection Nios2_2nd_Core.data_master VGA_Subsystem.pixel_dma_control_slave avalon
set_connection_parameter_value Nios2_2nd_Core.data_master/VGA_Subsystem.pixel_dma_control_slave baseAddress 0xff203020
add_connection Nios2_2nd_Core.instruction_master Nios2_2nd_Core.debug_mem_slave avalon
set_connection_parameter_value Nios2_2nd_Core.instruction_master/Nios2_2nd_Core.debug_mem_slave baseAddress 0x0a000000
add_connection Nios2_2nd_Core.instruction_master Onchip_SRAM.s2 avalon
set_connection_parameter_value Nios2_2nd_Core.instruction_master/Onchip_SRAM.s2 baseAddress 0x08000000
add_connection Nios2_2nd_Core.instruction_master SDRAM.s1 avalon
set_connection_parameter_value Nios2_2nd_Core.instruction_master/SDRAM.s1 baseAddress 0x0000
add_connection Pixel_DMA_Addr_Translation.master VGA_Subsystem.pixel_dma_control_slave avalon
set_connection_parameter_value Pixel_DMA_Addr_Translation.master/VGA_Subsystem.pixel_dma_control_slave baseAddress 0x0000
add_connection VGA_Subsystem.pixel_dma_master Onchip_SRAM.s2 avalon
set_connection_parameter_value VGA_Subsystem.pixel_dma_master/Onchip_SRAM.s2 baseAddress 0x08000000
add_connection VGA_Subsystem.pixel_dma_master SDRAM.s1 avalon
set_connection_parameter_value VGA_Subsystem.pixel_dma_master/SDRAM.s1 baseAddress 0x0000
add_connection ARM_A9_HPS.f2h_irq0 Audio_Subsystem.audio_irq interrupt
set_connection_parameter_value ARM_A9_HPS.f2h_irq0/Audio_Subsystem.audio_irq irqNumber 6
add_connection ARM_A9_HPS.f2h_irq0 Expansion_JP1.irq interrupt
set_connection_parameter_value ARM_A9_HPS.f2h_irq0/Expansion_JP1.irq irqNumber 11
add_connection ARM_A9_HPS.f2h_irq0 Expansion_JP2.irq interrupt
set_connection_parameter_value ARM_A9_HPS.f2h_irq0/Expansion_JP2.irq irqNumber 12
add_connection ARM_A9_HPS.f2h_irq0 Interval_Timer.irq interrupt
set_connection_parameter_value ARM_A9_HPS.f2h_irq0/Interval_Timer.irq irqNumber 0
add_connection ARM_A9_HPS.f2h_irq0 Interval_Timer_2.irq interrupt
set_connection_parameter_value ARM_A9_HPS.f2h_irq0/Interval_Timer_2.irq irqNumber 2
add_connection ARM_A9_HPS.f2h_irq0 IrDA.interrupt interrupt
set_connection_parameter_value ARM_A9_HPS.f2h_irq0/IrDA.interrupt irqNumber 9
add_connection ARM_A9_HPS.f2h_irq0 JTAG_UART_for_ARM_0.irq interrupt
set_connection_parameter_value ARM_A9_HPS.f2h_irq0/JTAG_UART_for_ARM_0.irq irqNumber 8
add_connection ARM_A9_HPS.f2h_irq0 PS2_Port.interrupt interrupt
set_connection_parameter_value ARM_A9_HPS.f2h_irq0/PS2_Port.interrupt irqNumber 7
add_connection ARM_A9_HPS.f2h_irq0 PS2_Port_Dual.interrupt interrupt
set_connection_parameter_value ARM_A9_HPS.f2h_irq0/PS2_Port_Dual.interrupt irqNumber 23
add_connection ARM_A9_HPS.f2h_irq0 Pushbuttons.irq interrupt
set_connection_parameter_value ARM_A9_HPS.f2h_irq0/Pushbuttons.irq irqNumber 1
add_connection ARM_A9_HPS.f2h_irq1 JTAG_UART_for_ARM_1.irq interrupt
set_connection_parameter_value ARM_A9_HPS.f2h_irq1/JTAG_UART_for_ARM_1.irq irqNumber 8
add_connection Nios2.irq Audio_Subsystem.audio_irq interrupt
set_connection_parameter_value Nios2.irq/Audio_Subsystem.audio_irq irqNumber 6
add_connection Nios2.irq Expansion_JP1.irq interrupt
set_connection_parameter_value Nios2.irq/Expansion_JP1.irq irqNumber 11
add_connection Nios2.irq Expansion_JP2.irq interrupt
set_connection_parameter_value Nios2.irq/Expansion_JP2.irq irqNumber 12
add_connection Nios2.irq Interval_Timer.irq interrupt
set_connection_parameter_value Nios2.irq/Interval_Timer.irq irqNumber 0
add_connection Nios2.irq Interval_Timer_2.irq interrupt
set_connection_parameter_value Nios2.irq/Interval_Timer_2.irq irqNumber 2
add_connection Nios2.irq IrDA.interrupt interrupt
set_connection_parameter_value Nios2.irq/IrDA.interrupt irqNumber 9
add_connection Nios2.irq JTAG_UART.irq interrupt
set_connection_parameter_value Nios2.irq/JTAG_UART.irq irqNumber 8
add_connection Nios2.irq PS2_Port.interrupt interrupt
set_connection_parameter_value Nios2.irq/PS2_Port.interrupt irqNumber 7
add_connection Nios2.irq PS2_Port_Dual.interrupt interrupt
set_connection_parameter_value Nios2.irq/PS2_Port_Dual.interrupt irqNumber 23
add_connection Nios2.irq Pushbuttons.irq interrupt
set_connection_parameter_value Nios2.irq/Pushbuttons.irq irqNumber 1
add_connection Nios2_2nd_Core.irq Audio_Subsystem.audio_irq interrupt
set_connection_parameter_value Nios2_2nd_Core.irq/Audio_Subsystem.audio_irq irqNumber 6
add_connection Nios2_2nd_Core.irq Expansion_JP1.irq interrupt
set_connection_parameter_value Nios2_2nd_Core.irq/Expansion_JP1.irq irqNumber 11
add_connection Nios2_2nd_Core.irq Expansion_JP2.irq interrupt
set_connection_parameter_value Nios2_2nd_Core.irq/Expansion_JP2.irq irqNumber 12
add_connection Nios2_2nd_Core.irq Interval_Timer_2nd_Core.irq interrupt
set_connection_parameter_value Nios2_2nd_Core.irq/Interval_Timer_2nd_Core.irq irqNumber 0
add_connection Nios2_2nd_Core.irq Interval_Timer_2nd_Core_2.irq interrupt
set_connection_parameter_value Nios2_2nd_Core.irq/Interval_Timer_2nd_Core_2.irq irqNumber 2
add_connection Nios2_2nd_Core.irq IrDA.interrupt interrupt
set_connection_parameter_value Nios2_2nd_Core.irq/IrDA.interrupt irqNumber 9
add_connection Nios2_2nd_Core.irq JTAG_UART_2nd_Core.irq interrupt
set_connection_parameter_value Nios2_2nd_Core.irq/JTAG_UART_2nd_Core.irq irqNumber 8
add_connection Nios2_2nd_Core.irq PS2_Port.interrupt interrupt
set_connection_parameter_value Nios2_2nd_Core.irq/PS2_Port.interrupt irqNumber 7
add_connection Nios2_2nd_Core.irq PS2_Port_Dual.interrupt interrupt
set_connection_parameter_value Nios2_2nd_Core.irq/PS2_Port_Dual.interrupt irqNumber 23
add_connection Nios2_2nd_Core.irq Pushbuttons.irq interrupt
set_connection_parameter_value Nios2_2nd_Core.irq/Pushbuttons.irq irqNumber 1
add_connection Nios2.custom_instruction_master Nios2_Floating_Point.s1 nios_custom_instruction
set_connection_parameter_value Nios2.custom_instruction_master/Nios2_Floating_Point.s1 CIName nios2_floating_point
set_connection_parameter_value Nios2.custom_instruction_master/Nios2_Floating_Point.s1 baseAddress 252
add_connection Nios2_2nd_Core.custom_instruction_master Nios2_Floating_Point_2nd_Core.s1 nios_custom_instruction
set_connection_parameter_value Nios2_2nd_Core.custom_instruction_master/Nios2_Floating_Point_2nd_Core.s1 CIName nios2_floating_point_2nd_core
set_connection_parameter_value Nios2_2nd_Core.custom_instruction_master/Nios2_Floating_Point_2nd_Core.s1 baseAddress 252

# exported interfaces
add_interface hps_io conduit end
set_interface_property hps_io EXPORT_OF ARM_A9_HPS.hps_io
add_interface leds conduit end
set_interface_property leds EXPORT_OF LEDs.external_connection
add_interface memory conduit end
set_interface_property memory EXPORT_OF ARM_A9_HPS.memory
add_interface sdram_clk clock source
set_interface_property sdram_clk EXPORT_OF System_PLL.sdram_clk
add_interface system_pll_ref_clk clock sink
set_interface_property system_pll_ref_clk EXPORT_OF System_PLL.ref_clk
add_interface system_pll_ref_reset reset sink
set_interface_property system_pll_ref_reset EXPORT_OF System_PLL.ref_reset

set_interconnect_requirement {$system} qsys_mm.clockCrossingAdapter HANDSHAKE
set_interconnect_requirement {$system} qsys_mm.enableEccProtection FALSE
set_interconnect_requirement {$system} qsys_mm.insertDefaultSlave FALSE
set_interconnect_requirement {$system} qsys_mm.maxAdditionalLatency 1

save_system Computer_System.qsys
